# Altium schematic sheet led.SchDoc
size Letter; CheckedBy: E. Chiu; CompanyName: Signal Laboratories, Inc.; DrawnBy: J. Brinton; Engineer: J. Brinton; Address1: 3479 Edison Way; Address2: Menlo Park CA 94025; Address3: +1 (877) 778-8435; Address4: siglabs.com; Revision: 1; SheetNumber: 26; SheetTotal: 40
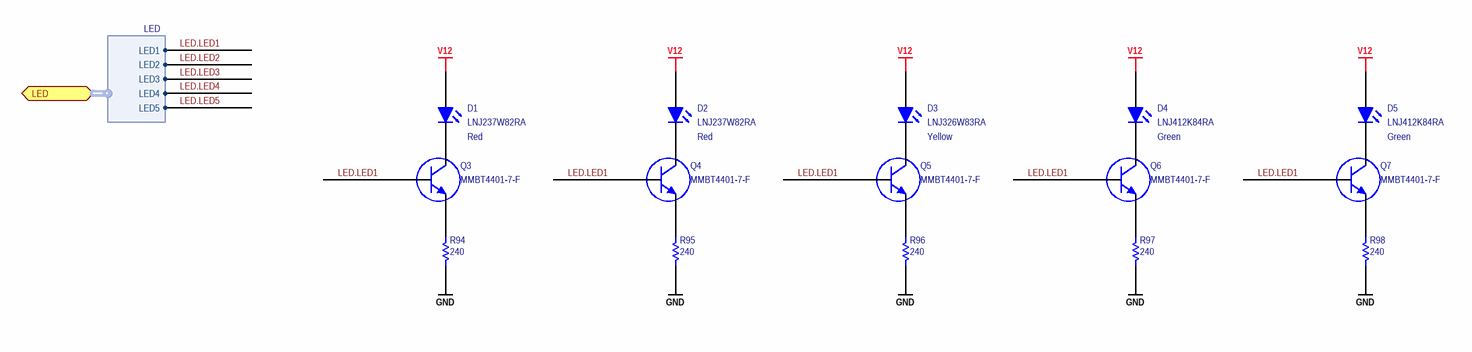
[diagram p0: led.SchDoc]

## Parts
D1  LNJ237W82RA  [0603_LED]
D2  LNJ237W82RA  [0603_LED]
D3  LNJ326W83RA  [0603_LED]
D4  LNJ412K84RA  [0603_LED]
D5  LNJ412K84RA  [0603_LED]
Q3  NPN Transistor  [SOT23]  (value not drawn)
Q4  NPN Transistor  [SOT23]  (value not drawn)
Q5  NPN Transistor  [SOT23]  (value not drawn)
Q6  NPN Transistor  [SOT23]  (value not drawn)
Q7  NPN Transistor  [SOT23]  (value not drawn)
R94  value 240  [RESC1608X55N]  (hidden comment: ERJ-3EKF2400V)
R95  value 240  [RESC1608X55N]  (hidden comment: ERJ-3EKF2400V)
R96  value 240  [RESC1608X55N]  (hidden comment: ERJ-3EKF2400V)
R97  value 240  [RESC1608X55N]  (hidden comment: ERJ-3EKF2400V)
R98  value 240  [RESC1608X55N]  (hidden comment: ERJ-3EKF2400V)

## Ports
LED (harness LED)

## Harnesses
LED: LED1, LED2, LED3, LED4, LED5

## Nets
GND: R94.2 R95.2 R96.2 R97.2 R98.2
V12: D1.1(A) D2.1(A) D3.1(A) D4.1(A) D5.1(A)
LED.LED1: Q3.1(B) Q4.1(B) Q5.1(B) Q6.1(B) Q7.1(B) ; port LED.LED1
LED.LED2: port LED.LED2
LED.LED3: port LED.LED3
LED.LED4: port LED.LED4
LED.LED5: port LED.LED5
NetD1_2: D1.2(K) Q3.3(C)
NetD2_2: D2.2(K) Q4.3(C)
NetD3_2: D3.2(K) Q5.3(C)
NetD4_2: D4.2(K) Q6.3(C)
NetD5_2: D5.2(K) Q7.3(C)
NetQ3_2: Q3.2(E) R94.1
NetQ4_2: Q4.2(E) R95.1
NetQ5_2: Q5.2(E) R96.1
NetQ6_2: Q6.2(E) R97.1
NetQ7_2: Q7.2(E) R98.1

## Notes on the sheet
- Red
- Yellow
- Green
- Title
- Engineer
- Revision
- Drawn By
- Checked By
- Date
- Sheet
- of

## Library data of the parts
D1 D2 = LED0603RD: LED, SMT 0603, Color Red, 5mA, 1.85V; Manufacturer: Panasonic; PCB Package: 0603 Polarized; Manufacturer P/N: LNJ237W82RA
D3 = LED0603GR: LED, SMT 0603, Color Green, 10mA, 2.05V; Manufacturer: Panasonic; PCB Package: 0603 Polarized; Manufacturer P/N: LNJ326W83RA
D4 D5 = LED0603Y: LED, SMT 0603, Color Yellow, 10mA, 2.05V; Manufacturer: Panasonic; PCB Package: 0603 Polarized; Manufacturer P/N: LNJ412K84RA
Q3-Q7 = MMBT4401-7-F: NPN Small Signal Transistor SMD SOT-23; Manufacturer: Diodes, Inc.; Manufacturer P/N: MMBT4401-7-F
R94-R98 = RES 0603 10k 1%: Thick Film Resistor 240 Ohms +/-1% 0.1W 75V SMD 0603; Manufacturer: Panasonic - ECG; Tcr: +/-100; Tr: -55:+155; Tolerance: +/-1%; Manufacturer P/N: ERJ-3EKF2400V; Voltage: 75V; Power: 0.1W